# Altium project MAX51.PrjPCB
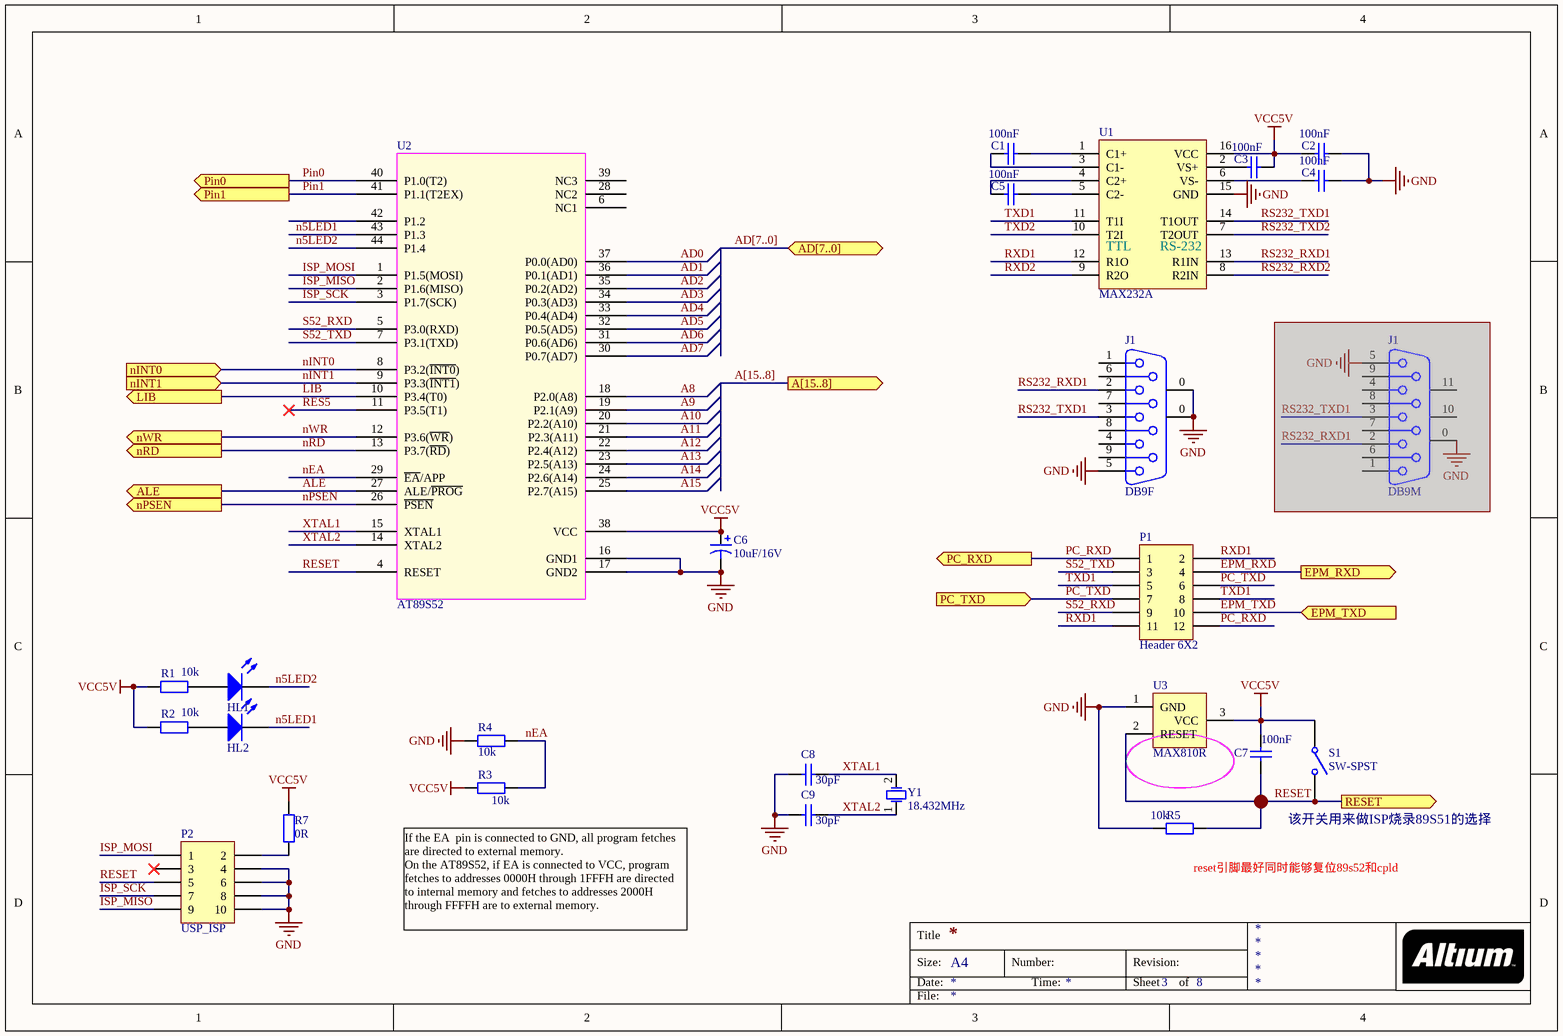
[diagram p0: AT89S52.SchDoc]
5 sheets, 64 parts. Net scope: flat (ports and power ports of the same name join across sheets).
Board file: MAX51.PcbDoc
Sheets:
  AT89S52.SchDoc
  SN74LVC4245A.SchDoc
  LCD.SchDoc
  EEPROM.SchDoc
  Readme.SchDoc

## Sheet AT89S52.SchDoc
size A4; SheetNumber: 3; SheetTotal: 8

### Parts
(Parts that share a designator on the sheet are numbered #1, #2 ... from top to bottom, then left to right.)
C1  100nF  [R0603]
C2  100nF  [R0603]
C3  100nF  [R0603]
C4  100nF  [R0603]
C5  100nF  [R0603]
C6  10uF/16V  [C0805]
C7  100nF  [R0603]
C8  30pF  [R0603]
C9  30pF  [R0603]
HL1  LED  [LED_0603]  (value not drawn)
HL2  LED  [LED_0603]  (value not drawn)
J1#1  DB9F  [DB9/F]
J1#2  DB9M  (masked out: inside a compile mask, not in the netlist)
P1  Header 6X2  [HDR2X6]
P2  USP_ISP  [HDR2X5]
R1  10k  [R0603]
R2  10k  [R0603]
R3  10k  [R0603]
R4  10k  [R0603]
R5  10k  [R0603]
R7  0R  [R0603]
S1  SW-SPST  [K1]
U1  MAX232A  [NSO16_M]
U2  AT89S52  [AT89S52-TQFP44]
U3  MAX810R  [MAX810R-SOT23]
Y1  18.432MHz  [XTAL]

### Ports
A[15..8] (out), AD[7..0] (bidir), ALE (out), EPM_RXD (out), EPM_TXD (in), LIB (out), nINT0 (in), nINT1 (in), nPSEN (out), nRD (out), nWR (out), PC_RXD (out), PC_TXD (in), Pin0 (out), Pin1 (out), RESET (out)

### Nets
GND: C2.1 C4.1 C6.2 C8.2 C9.2 J1#1.0(MH2) J1#1.5 P2.4 P2.6 P2.8 P2.10 R4.1 R5.1 U1.15(GND) U2.16(GND1) U2.17(GND2) U3.1(GND)
VCC5V: C2.2 C3.1 C6.1 C7.2 R1.2 R2.2 R3.2 R7.1 S1.1(COMMON) U1.16(VCC) U2.38(VCC) U3.3(VCC)
A8: U2.18(P2.0(A8))
A9: U2.19(P2.1(A9))
A10: U2.20(P2.2(A10))
A11: U2.21(P2.3(A11))
A12: U2.22(P2.4(A12))
A13: U2.23(P2.5(A13))
A14: U2.24(P2.6(A14))
A15: U2.25(P2.7(A15))
AD0: U2.37(P0.0(AD0))
AD1: U2.36(P0.1(AD1))
AD2: U2.35(P0.2(AD2))
AD3: U2.34(P0.3(AD3))
AD4: U2.33(P0.4(AD4))
AD5: U2.32(P0.5(AD5))
AD6: U2.31(P0.6(AD6))
AD7: U2.30(P0.7(AD7))
ALE: U2.27(ALE/~{PROG}) ; port ALE
EPM_RXD: P1.4 ; port EPM_RXD
EPM_TXD: P1.10 ; port EPM_TXD
ISP_MISO: P2.9 U2.2(P1.6(MISO))
ISP_MOSI: P2.1 U2.1(P1.5(MOSI))
ISP_SCK: P2.7 U2.3(P1.7(SCK))
LIB: U2.10(P3.4(T0)) ; port LIB
n5LED1: HL2.K U2.43(P1.3)
n5LED2: HL1.K U2.44(P1.4)
nEA: R3.1 R4.2 U2.29(~{EA}/APP)
nINT0: U2.8(P3.2(~{INT0})) ; port nINT0
nINT1: U2.9(P3.3(~{INT1})) ; port nINT1
nPSEN: U2.26(~{PSEN}) ; port nPSEN
nRD: U2.13(P3.7(~{RD})) ; port nRD
nWR: U2.12(P3.6(~{WR})) ; port nWR
PC_RXD: P1.1 P1.12 ; port PC_RXD
PC_TXD: P1.6 P1.7 ; port PC_TXD
Pin0: U2.40(P1.0(T2)) ; port Pin0
Pin1: U2.41(P1.1(T2EX)) ; port Pin1
RES5: U2.11(P3.5(T1))
RESET: C7.1 P2.5 R5.2 S1.2(NO) U2.4(RESET) U3.2(RESET) ; port RESET
RS232_RXD1: J1#1.2 U1.13(R1IN)
RS232_RXD2: U1.8(R2IN)
RS232_TXD1: J1#1.3 U1.14(T1OUT)
RS232_TXD2: U1.7(T2OUT)
RXD1: P1.2 P1.11 U1.12(R1O)
RXD2: U1.9(R2O)
S52_RXD: P1.9 U2.5(P3.0(RXD))
S52_TXD: P1.3 U2.7(P3.1(TXD))
TXD1: P1.5 P1.8 U1.11(T1I)
TXD2: U1.10(T2I)
XTAL1: C8.1 U2.15(XTAL1) Y1.2(OSC2)
XTAL2: C9.1 U2.14(XTAL2) Y1.1(OSC1)
NetC1_1: C1.1 U1.1(C1+)
NetC1_2: C1.2 U1.3(C1-)
NetC3_2: C3.2 U1.2(VS+)
NetC4_2: C4.2 U1.6(VS-)
NetC5_1: C5.1 U1.5(C2-)
NetC5_2: C5.2 U1.4(C2+)
NetHL1_A: HL1.A R1.1
NetHL2_A: HL2.A R2.1
NetP2_2: P2.2 R7.2

Not connected (* = marked no-connect by the designer): J1#1 1 4 6 7 8 9; P2 3*; U2 6(NC1) 28(NC2) 39(NC3) 42(P1.2)

### Buses and harness runs
bus A[15..8] = port A[15..8]
bus AD[7..0] = port AD[7..0]

### Notes on the sheet
- 该开关用来做ISP烧录89S51的选择
- (near R3) If the EA  pin is connected to GND, all program fetches
  are directed to external memory.
  On the AT89S52, if EA is connected to VCC, program
  fetches to addresses 0000H through 1FFFH are directed
  to internal memory and fetches to addresses 2000H
  through FFFFH are to external memory.
- (near R5) reset引脚最好同时能够复位89s52和cpld
- Title
- Size:
- Date:
- A4
- Number:
- Time:
- Revision:
- Sheet
- of
- File:
- (in symbol MAX232A) TTL; RS-232

### Library data of the parts
C1-C5 C7 = CAP_04: Value: 100nF
C6 = CAP_A
C8 C9 = CAP_04: Value: 100nF
HL1 HL2 = LED 2
P1 = Header 6X2: Header, 6-Pin, Dual row; LatestRevisionDate: 17-Jul-2002; LatestRevisionNote: Re-released for DXP Platform.; Publisher: Altium Limited
P2 = Header 5X2: Header, 5-Pin, Dual row; LatestRevisionDate: 17-Jul-2002; LatestRevisionNote: Re-released for DXP Platform.; Publisher: Altium Limited
R1 R2 = RES_04: Value: 10K
R3 = RES_04: 0402R; Value: 10K
R4 R5 = RES_04: 0402; Value: 10K
R7 = RES_04: 0402R; Value: 10K
S1 = SW-SPST: Single-Pole, Single-Throw Switch; Published: 24-Mar-1999; LatestRevisionDate: 17-Jul-2002; LatestRevisionNote: Re-released for DXP Platform.; PackageReference: SPST-2; Publisher: Altium Limited; PackageDescription: Switch; 2 Leads
U1 = MAX232A: +5V-Powered, Multichannel RS-232 Drivers/Receivers
U2 = AT89S52-24U
Y1 = XTAL: Passive crystal

## Sheet SN74LVC4245A.SchDoc
size A4; Organization: Altium Limited; Address1: L3, 12a Rodborough Rd; Address2: Frenchs Forest; Address3: NSW; Address4: Australia 2086; SheetNumber: 5; SheetTotal: 8
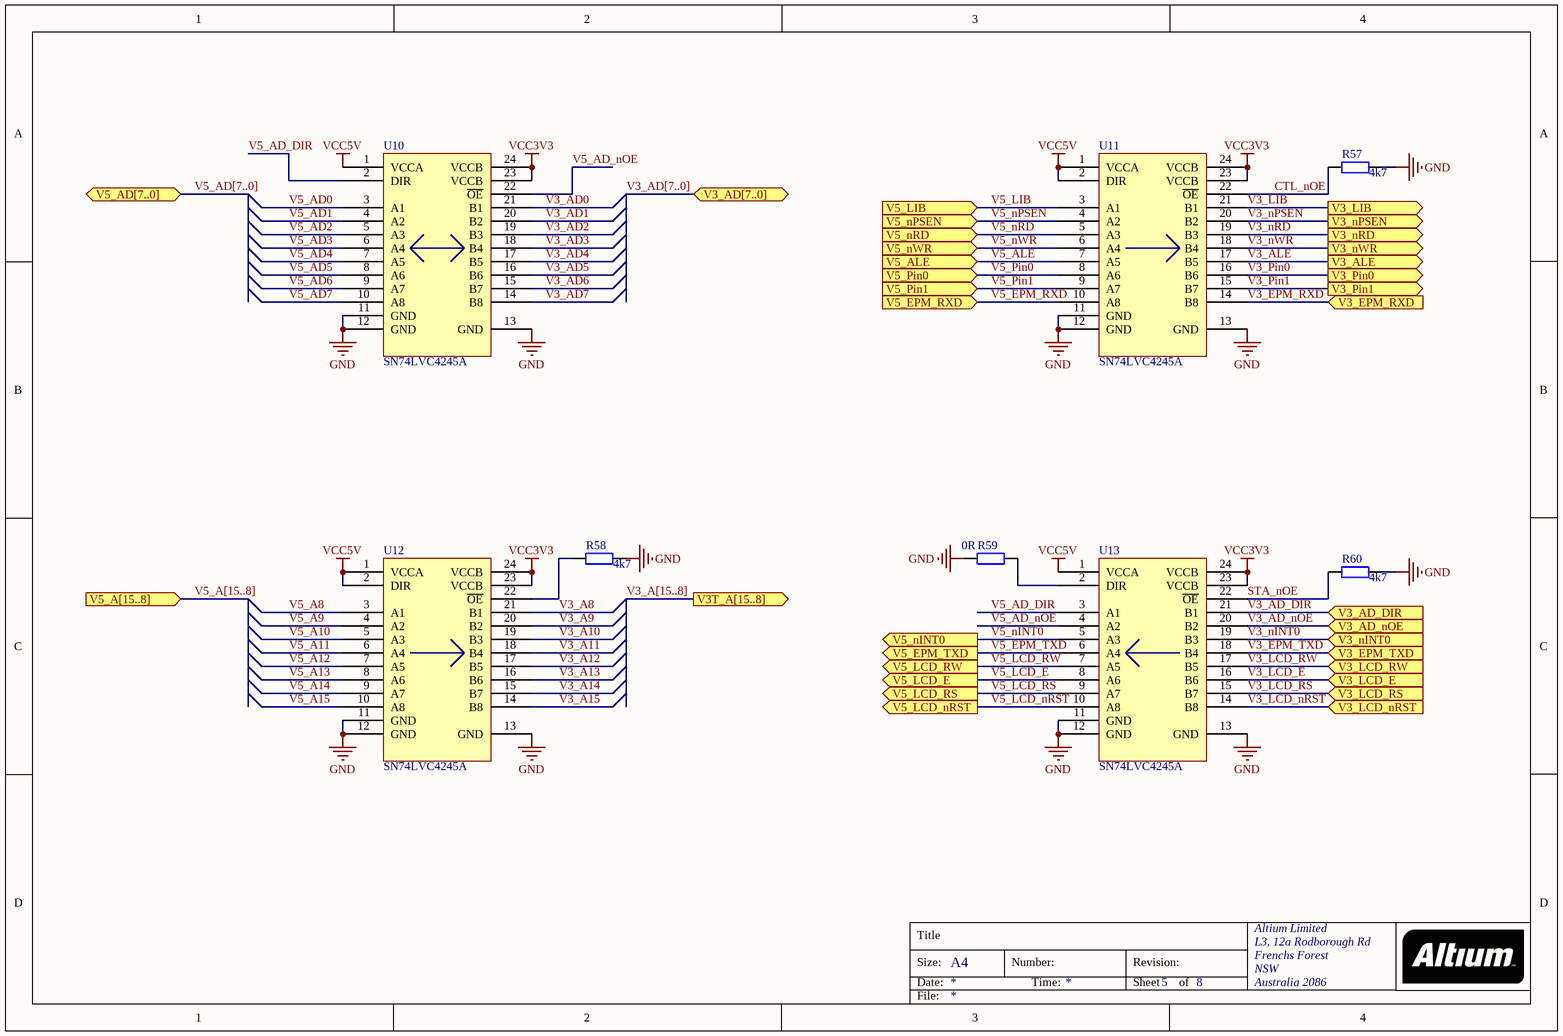
[diagram p1: SN74LVC4245A.SchDoc]

### Parts
R57  4k7  [R0603]
R58  4k7  [R0603]
R59  0R  [R0603]
R60  4k7  [R0603]
U10  SN74LVC4245A  [TSSOP-24]
U11  SN74LVC4245A  [TSSOP-24]
U12  SN74LVC4245A  [TSSOP-24]
U13  SN74LVC4245A  [TSSOP-24]

### Ports
V3_AD[7..0] (bidir), V3_AD_DIR (in), V3_AD_nOE (in), V3_ALE (out), V3_EPM_RXD (in), V3_EPM_TXD (in), V3_LCD_E (in), V3_LCD_nRST (in), V3_LCD_RS (in), V3_LCD_RW (in), V3_LIB (out), V3_nINT0 (in), V3_nPSEN (out), V3_nRD (out), V3_nWR (out), V3_Pin0 (out), V3_Pin1 (out), V3T_A[15..8] (out), V5_A[15..8] (in), V5_AD[7..0] (bidir), V5_ALE (in), V5_EPM_RXD (in), V5_EPM_TXD (out), V5_LCD_E (out), V5_LCD_nRST (out), V5_LCD_RS (out), V5_LCD_RW (out), V5_LIB (in), V5_nINT0 (out), V5_nPSEN (in), V5_nRD (in), V5_nWR (in), V5_Pin0 (in), V5_Pin1 (in)

### Nets
GND: R57.1 R58.1 R59.2 R60.1 U10.11(GND) U10.12(GND) U10.13(GND) U11.11(GND) U11.12(GND) U11.13(GND) U12.11(GND) U12.12(GND) U12.13(GND) U13.11(GND) U13.12(GND) U13.13(GND)
VCC3V3: U10.23(VCCB) U10.24(VCCB) U11.23(VCCB) U11.24(VCCB) U12.23(VCCB) U12.24(VCCB) U13.23(VCCB) U13.24(VCCB)
VCC5V: U10.1(VCCA) U11.1(VCCA) U11.2(DIR) U12.1(VCCA) U12.2(DIR) U13.1(VCCA)
CTL_nOE: R57.2 U11.22(~{OE})
STA_nOE: R60.2 U13.22(~{OE})
V3_A8: U12.21(B1)
V3_A9: U12.20(B2)
V3_A10: U12.19(B3)
V3_A11: U12.18(B4)
V3_A12: U12.17(B5)
V3_A13: U12.16(B6)
V3_A14: U12.15(B7)
V3_A15: U12.14(B8)
V3_AD0: U10.21(B1)
V3_AD1: U10.20(B2)
V3_AD2: U10.19(B3)
V3_AD3: U10.18(B4)
V3_AD4: U10.17(B5)
V3_AD5: U10.16(B6)
V3_AD6: U10.15(B7)
V3_AD7: U10.14(B8)
V3_AD_DIR: U13.21(B1) ; port V3_AD_DIR
V3_AD_nOE: U13.20(B2) ; port V3_AD_nOE
V3_ALE: U11.17(B5) ; port V3_ALE
V3_EPM_RXD: U11.14(B8) ; port V3_EPM_RXD
V3_EPM_TXD: U13.18(B4) ; port V3_EPM_TXD
V3_LCD_E: U13.16(B6) ; port V3_LCD_E
V3_LCD_nRST: U13.14(B8) ; port V3_LCD_nRST
V3_LCD_RS: U13.15(B7) ; port V3_LCD_RS
V3_LCD_RW: U13.17(B5) ; port V3_LCD_RW
V3_LIB: U11.21(B1) ; port V3_LIB
V3_nINT0: U13.19(B3) ; port V3_nINT0
V3_nPSEN: U11.20(B2) ; port V3_nPSEN
V3_nRD: U11.19(B3) ; port V3_nRD
V3_nWR: U11.18(B4) ; port V3_nWR
V3_Pin0: U11.16(B6) ; port V3_Pin0
V3_Pin1: U11.15(B7) ; port V3_Pin1
V5_A8: U12.3(A1)
V5_A9: U12.4(A2)
V5_A10: U12.5(A3)
V5_A11: U12.6(A4)
V5_A12: U12.7(A5)
V5_A13: U12.8(A6)
V5_A14: U12.9(A7)
V5_A15: U12.10(A8)
V5_AD0: U10.3(A1)
V5_AD1: U10.4(A2)
V5_AD2: U10.5(A3)
V5_AD3: U10.6(A4)
V5_AD4: U10.7(A5)
V5_AD5: U10.8(A6)
V5_AD6: U10.9(A7)
V5_AD7: U10.10(A8)
V5_AD_DIR: U10.2(DIR) U13.3(A1)
V5_AD_nOE: U10.22(~{OE}) U13.4(A2)
V5_ALE: U11.7(A5) ; port V5_ALE
V5_EPM_RXD: U11.10(A8) ; port V5_EPM_RXD
V5_EPM_TXD: U13.6(A4) ; port V5_EPM_TXD
V5_LCD_E: U13.8(A6) ; port V5_LCD_E
V5_LCD_nRST: U13.10(A8) ; port V5_LCD_nRST
V5_LCD_RS: U13.9(A7) ; port V5_LCD_RS
V5_LCD_RW: U13.7(A5) ; port V5_LCD_RW
V5_LIB: U11.3(A1) ; port V5_LIB
V5_nINT0: U13.5(A3) ; port V5_nINT0
V5_nPSEN: U11.4(A2) ; port V5_nPSEN
V5_nRD: U11.5(A3) ; port V5_nRD
V5_nWR: U11.6(A4) ; port V5_nWR
V5_Pin0: U11.8(A6) ; port V5_Pin0
V5_Pin1: U11.9(A7) ; port V5_Pin1
NetR58_2: R58.2 U12.22(~{OE})
NetR59_1: R59.1 U13.2(DIR)

### Buses and harness runs
bus V3_A[15..8] = port V3T_A[15..8]
bus V3_AD[7..0] = port V3_AD[7..0]
bus V5_A[15..8] = port V5_A[15..8]
bus V5_AD[7..0] = port V5_AD[7..0]

### Notes on the sheet
- Title
- Size:
- Date:
- A4
- Number:
- Time:
- Revision:
- Sheet
- of
- File:

### Library data of the parts
R57-R60 = RES_04
  R57 R58 R60: Value: 4k7
  R59: Value: 0R
U10-U13 = SN74LVC4245A-SOIC

## Sheet LCD.SchDoc
size A4; Organization: Altium Limited; Address1: L3, 12a Rodborough Rd; Address2: Frenchs Forest; Address3: NSW; Address4: Australia 2086
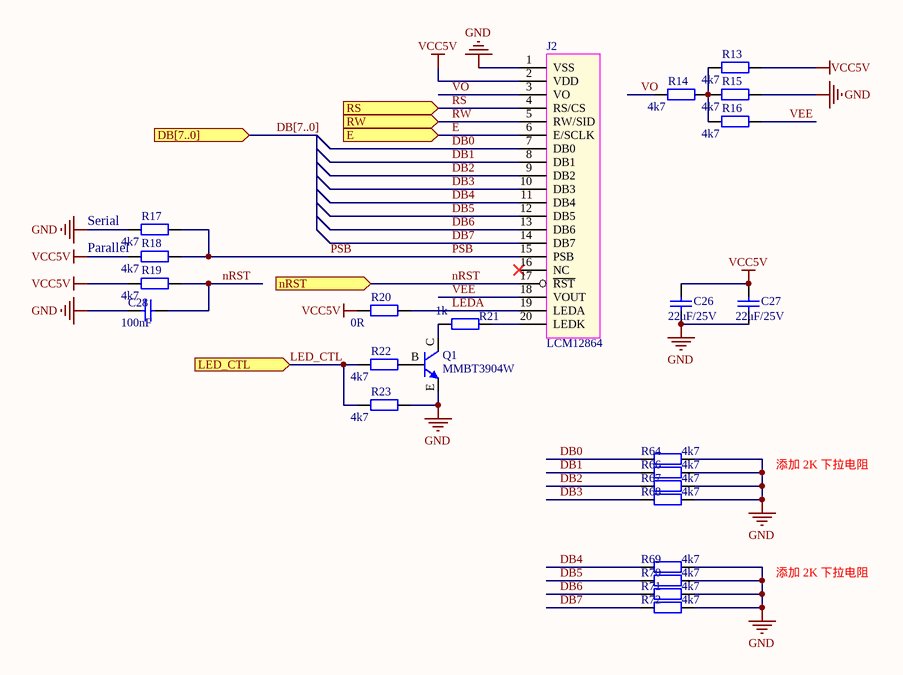
[diagram p2: LCD.SchDoc]

### Parts
C26  22uF/25V  [C0805]
C27  22uF/25V  [C0805]
C28  100nF  [R0603]
J2  LCM12864  [LCD12864]
Q1  MMBT3904W  [SOT_23]
R13  4k7  [R0603]
R14  4k7  [R0603]
R15  4k7  [R0603]
R16  4k7  [R0603]
R17  4k7  [R0603]
R18  4k7  [R0603]
R19  4k7  [R0603]
R20  0R  [R0603]
R21  1k  [R0603]
R22  4k7  [R0603]
R23  4k7  [R0603]
R64  4k7  [R0603]
R66  4k7  [R0603]
R67  4k7  [R0603]
R68  4k7  [R0603]
R69  4k7  [R0603]
R70  4k7  [R0603]
R71  4k7  [R0603]
R72  4k7  [R0603]

### Ports
DB[7..0] (in), E (in), LED_CTL (in), nRST (in), RS (in), RW (in)

### Nets
GND: C26.1 C27.1 C28.1 J2.1(VSS) Q1.E R15.2 R17.1 R23.2 R64.2 R66.2 R67.2 R68.2 R69.2 R70.2 R71.2 R72.2
VCC5V: C26.2 C27.2 J2.2(VDD) R13.2 R18.1 R19.1 R20.1
DB0: J2.7(DB0) R64.1
DB1: J2.8(DB1) R66.1
DB2: J2.9(DB2) R67.1
DB3: J2.10(DB3) R68.1
DB4: J2.11(DB4) R69.1
DB5: J2.12(DB5) R70.1
DB6: J2.13(DB6) R71.1
DB7: J2.14(DB7) R72.1
E: J2.6(E/SCLK) ; port E
LED_CTL: R22.1 R23.1 ; port LED_CTL
LEDA: J2.19(LEDA) R20.2
nRST: C28.2 J2.17(~{RST}) R19.2 ; port nRST
PSB: J2.15(PSB) R17.2 R18.2
RS: J2.4(RS/CS) ; port RS
RW: J2.5(RW/SID) ; port RW
VEE: J2.18(VOUT) R16.2
VO: J2.3(VO) R14.1
NetJ2_20: J2.20(LEDK) R21.2
NetQ1_B: Q1.B R22.2
NetQ1_C: Q1.C R21.1
NetR13_1: R13.1 R14.2 R15.1 R16.1

Not connected (* = marked no-connect by the designer): J2 16(NC)*

### Buses and harness runs
bus DB[7..0] = port DB[7..0]

### Notes on the sheet
- (near R17) Serial
- (near R18) Parallel
- 添加 2K 下拉电阻
- Title
- Size:
- Date:
- A4
- Number:
- Time:
- Revision:
- Sheet
- of
- File:

### Library data of the parts
C26 C27 = CAP_08
C28 = CAP_04: Value: 100nF
J2 = LCM12864: ST7920/LCM12864
Q1 = MMBT3904TT1G
R13-R19 R21-R23 R64 R66-R72 = RES_04
  R13-R19: Value: 4K7
  R21: Value: 1k
  R22 R23 R64 R66-R72: Value: 4k7
R20 = RES_04: Value: 0

## Sheet EEPROM.SchDoc
size A4; Organization: Altium Limited; Address1: L3, 12a Rodborough Rd; Address2: Frenchs Forest; Address3: NSW; Address4: Australia 2086
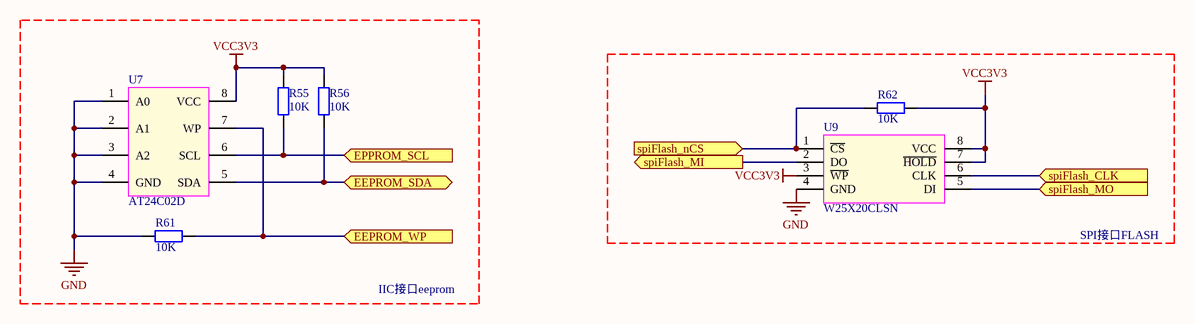
[diagram p3: EEPROM.SchDoc]

### Parts
R55  10K  [R0603]
R56  10K  [R0603]
R61  10K  [R0603]
R62  10K  [R0603]
U7  AT24C02D  [SOP8]
U9  W25X20CLSN  [SOP8]

### Ports
EEPROM_SDA (bidir), EEPROM_WP (in), EPPROM_SCL (in), spiFlash_CLK (in), spiFlash_MI (out), spiFlash_MO (in), spiFlash_nCS (in)

### Nets
GND: R61.1 U7.1(A0) U7.2(A1) U7.3(A2) U7.4(GND) U9.4(GND)
VCC3V3: R55.1 R56.1 R62.2 U7.8(VCC) U9.3(~{WP}) U9.7(~{HOLD}) U9.8(VCC)
NetR55_2: R55.2 U7.6(SCL) ; port EPPROM_SCL
NetR56_2: R56.2 U7.5(SDA) ; port EEPROM_SDA
NetR61_2: R61.2 U7.7(WP) ; port EEPROM_WP
NetR62_1: R62.1 U9.1(~{CS}) ; port spiFlash_nCS
NetU9_2: U9.2(DO) ; port spiFlash_MI
NetU9_5: U9.5(DI) ; port spiFlash_MO
NetU9_6: U9.6(CLK) ; port spiFlash_CLK

### Notes on the sheet
- IIC接口eeprom
- SPI接口FLASH
- Title
- Size:
- Date:
- A4
- Number:
- Time:
- Revision:
- Sheet
- of
- File:

### Library data of the parts
R55 R56 R61 R62 = RES_06
U7 = AT24C02D: EEPROM
U9 = W25X20CLSN: 2M-bit/256K Byte(262,144)

## Sheet Readme.SchDoc
size A4
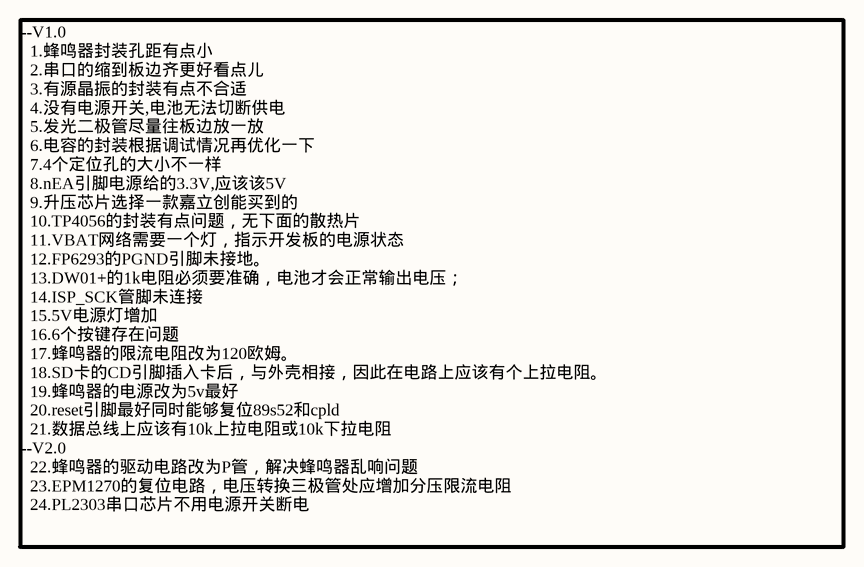
[diagram p4: Readme.SchDoc]

### Notes on the sheet
- --V1.0
  1.蜂鸣器封装孔距有点小
  2.串口的缩到板边齐更好看点儿
  3.有源晶振的封装有点不合适
  4.没有电源开关,电池无法切断供电
  5.发光二极管尽量往板边放一放
  6.电容的封装根据调试情况再优化一下
  7.4个定位孔的大小不一样
  8.nEA引脚电源给的3.3V,应该该5V
  9.升压芯片选择一款嘉立创能买到的
  10.TP4056的封装有点问题，无下面的散热片
  11.VBAT网络需要一个灯，指示开发板的电源状态
  12.FP6293的PGND引脚未接地。
  13.DW01+的1k电阻必须要准确，电池才会正常输出电压；
  14.ISP_SCK管脚未连接
  15.5V电源灯增加
  16.6个按键存在问题
  17.蜂鸣器的限流电阻改为120欧姆。
  18.SD卡的CD引脚插入卡后，与外壳相接，因此在电路上应该有个上拉电阻。
  19.蜂鸣器的电源改为5v最好
  20.reset引脚最好同时能够复位89s52和cpld
  21.数据总线上应该有10k上拉电阻或10k下拉电阻
  --V2.0
  22.蜂鸣器的驱动电路改为P管，解决蜂鸣器乱响问题
  23.EPM1270的复位电路，电压转换三极管处应增加分压限流电阻
  24.PL2303串口芯片不用电源开关断电

## Nets that join several sheets
GND: AT89S52 (17 pins), SN74LVC4245A (16 pins), LCD (16 pins), EEPROM (6 pins)
VCC3V3: SN74LVC4245A (8 pins), EEPROM (7 pins)
VCC5V: AT89S52 (12 pins), SN74LVC4245A (6 pins), LCD (7 pins)